# Altium schematic sheet Sheet1.SchDoc
size A
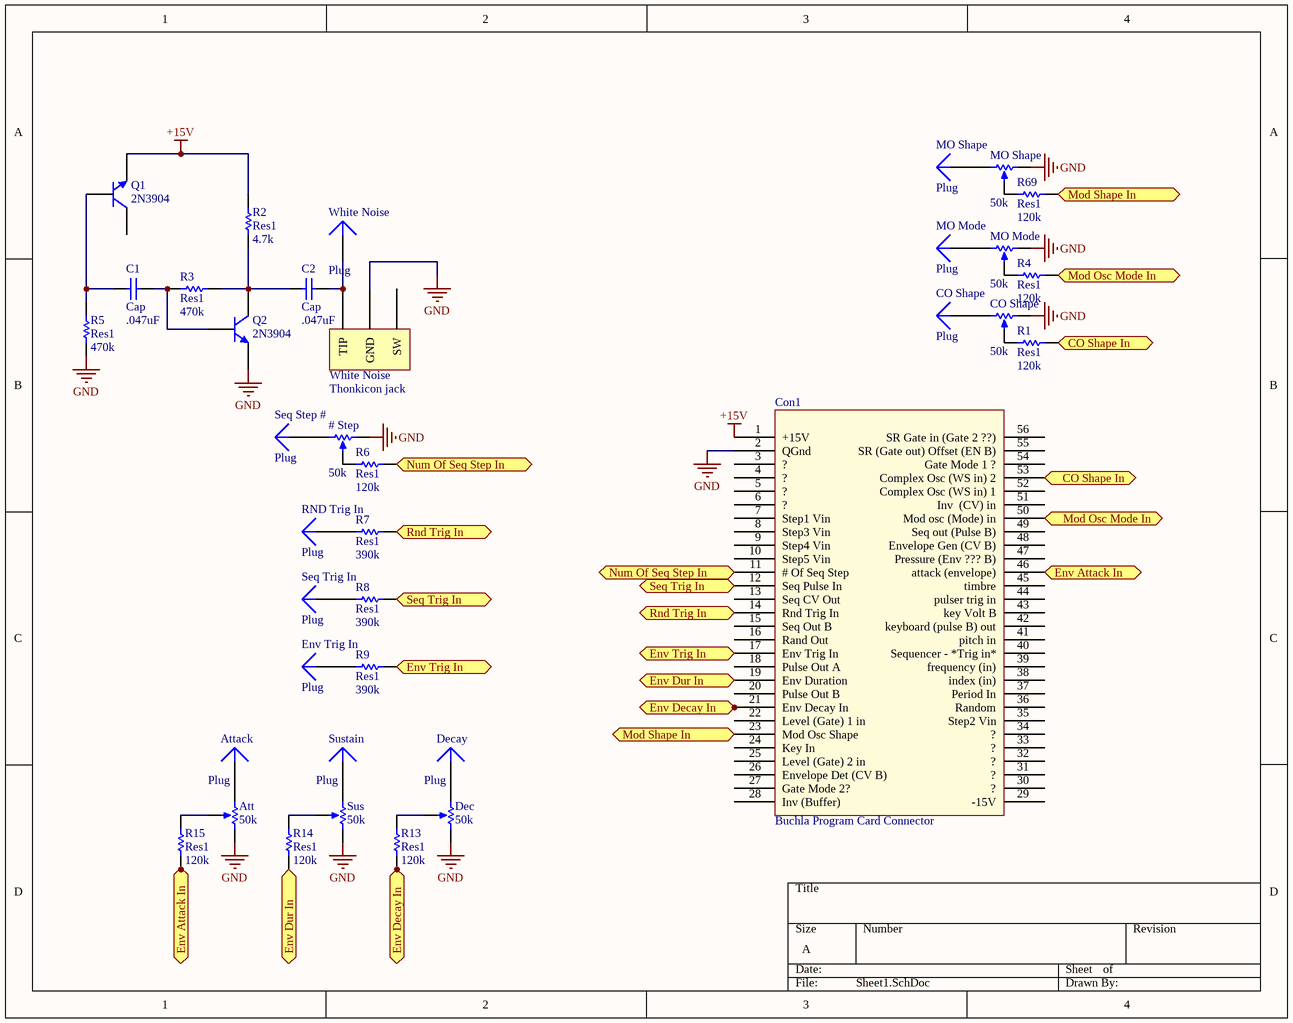
[diagram p0: Sheet1.SchDoc]

## Parts
(Parts that share a designator on the sheet are numbered #1, #2 ... from top to bottom, then left to right.)
#_Step  50k  [SonGueiPot]
Att  50k  [SonGueiPot]
Attack  Plug  [PIN1]
C1  Cap  value .047uF  [RAD-0.3]
C2  Cap  value .047uF  [RAD-0.3]
CO_Shape#1  Plug  [PIN1]
CO_Shape#2  50k  [SonGueiPot]
Con1  Buchla Program Card Connector  [PCBComponent_1]
Dec  50k  [SonGueiPot]
Decay  Plug  [PIN1]
Env_Trig_In  Plug  [PIN1]
MO_Mode#1  Plug  [PIN1]
MO_Mode#2  50k  [SonGueiPot]
MO_Shape#1  Plug  [PIN1]
MO_Shape#2  50k  [SonGueiPot]
Q1  2N3904  [TO-92A]
Q2  2N3904  [TO-92A]
R1  Res1  value 120k  [AXIAL-0.3]
R2  Res1  value 4.7k  [AXIAL-0.3]
R3  Res1  value 470k  [AXIAL-0.3]
R4  Res1  value 120k  [AXIAL-0.3]
R5  Res1  value 470k  [AXIAL-0.3]
R6  Res1  value 120k  [AXIAL-0.3]
R7  Res1  value 390k  [AXIAL-0.3]
R8  Res1  value 390k  [AXIAL-0.3]
R9  Res1  value 390k  [AXIAL-0.3]
R13  Res1  value 120k  [AXIAL-0.3]
R14  Res1  value 120k  [AXIAL-0.3]
R15  Res1  value 120k  [AXIAL-0.3]
R69  Res1  value 120k  [AXIAL-0.3]
RND_Trig_In  Plug  [PIN1]
Seq_Step_#  Plug  [PIN1]
Seq_Trig_In  Plug  [PIN1]
Sus  50k  [SonGueiPot]
Sustain  Plug  [PIN1]
White_Noise#1  Plug  [PIN1]
White_Noise#2  Thonkicon jack  [Thonkiconn Pot PJ301M]

## Ports
CO Shape In, Env Attack In, Env Decay In, Env Dur In, Env Trig In, Mod Osc Mode In, Mod Shape In, Num Of Seq Step In, Rnd Trig In, Seq Trig In

## Nets
+15V: Con1.1(+15V) Q1.1(E) R2.1
GND: #_Step.1(CCW) Att.1(CCW) CO_Shape#2.1(CCW) Con1.2(QGnd) Dec.1(CCW) MO_Mode#2.1(CCW) MO_Shape#2.1(CCW) Q2.1(E) R5.1 Sus.1(CCW) White_Noise#2.1(GND)
CO Shape In: Con1.53(Complex_Osc_(WS_in)_2) R1.2 ; port CO Shape In
Env Attack In: Con1.46(attack_(envelope)) ; port Env Attack In
Env Decay In: Con1.21(Env_Decay_In) R13.1 ; port Env Decay In
Env Dur In: Con1.19(Env_Duration) R14.1 ; port Env Dur In
Env Trig In: Con1.17(Env_Trig_In) R9.2 ; port Env Trig In
Mod Osc Mode In: Con1.50(Mod_osc_(Mode)_in) R4.2 ; port Mod Osc Mode In
Mod Shape In: Con1.23(Mod_Osc_Shape) R69.2 ; port Mod Shape In
Num Of Seq Step In: Con1.11(#_Of_Seq_Step) R6.2 ; port Num Of Seq Step In
Rnd Trig In: Con1.14(Rnd_Trig_In) R7.2 ; port Rnd Trig In
Seq Trig In: Con1.12(Seq_Pulse_In) R8.2 ; port Seq Trig In
Net#_Step_2: #_Step.2(WIPER) R6.1
Net#_Step_3: #_Step.3(CW) Seq_Step_#.1
NetAtt_2: Att.2(WIPER) R15.2
NetAtt_3: Att.3(CW) Attack.1
NetC1_1: C1.1 Q1.2(B) R5.2
NetC1_2: C1.2 Q2.2(B) R3.2
NetC2_1: C2.1 Q2.3(C) R2.2 R3.1
NetC2_2: C2.2 White_Noise#1.1 White_Noise#2.3(TIP)
NetCO_Shape#1_1: CO_Shape#1.1 CO_Shape#2.3(CW)
NetCO_Shape#2_2: CO_Shape#2.2(WIPER) R1.1
NetDec_2: Dec.2(WIPER) R13.2
NetDec_3: Dec.3(CW) Decay.1
NetEnv_Trig_In_1: Env_Trig_In.1 R9.1
NetMO_Mode#1_1: MO_Mode#1.1 MO_Mode#2.3(CW)
NetMO_Mode#2_2: MO_Mode#2.2(WIPER) R4.1
NetMO_Shape#1_1: MO_Shape#1.1 MO_Shape#2.3(CW)
NetMO_Shape#2_2: MO_Shape#2.2(WIPER) R69.1
NetR7_1: R7.1 RND_Trig_In.1
NetR8_1: R8.1 Seq_Trig_In.1
NetR14_2: R14.2 Sus.2(WIPER)
NetSus_3: Sus.3(CW) Sustain.1

Not connected (* = marked no-connect by the designer): Con1 3(?) 4(?) 5(?) 6(?) 7(Step1_Vin) 8(Step3_Vin) 9(Step4_Vin) 10(Step5_Vin) 13(Seq_CV_Out) 15(Seq_Out_B) 16(Rand_Out) 18(Pulse_Out_A) 20(Pulse_Out_B) 22(Level_(Gate)_1_in) 24(Key_In) 25(Level_(Gate)_2_in) 26(Envelope_Det_(CV_B)) 27(Gate_Mode_2?) 28(Inv_(Buffer)) 29(-15V) 30(?) 31(?) 32(?) 33(?) 34(?) 35(Step2_Vin) 36(Random) 37(Period_In) 38(index_(in)) 39(frequency_(in)) 40(Sequencer_-_*Trig_in*) 41(pitch_in) 42(keyboard_(pulse_B)_out) 43(key_Volt_B) 44(pulser_trig_in) 45(timbre) 47(Pressure_(Env_???_B)) 48(Envelope_Gen_(CV_B)) 49(Seq_out_(Pulse_B)) 51(Inv__(CV)_in) 52(Complex_Osc_(WS_in)_1) 54(Gate_Mode_1_?) 55(SR_(Gate_out)_Offset_(EN_B)) 56(SR_Gate_in_(Gate_2_??)); Q1 3(C); R15 1; White_Noise#2 2(SW)

## Library data of the parts
#_Step Att CO_Shape#2 Dec MO_Mode#2 MO_Shape#2 Sus = CMP-0972-00009-1: Trimming Potentiometer, 5K Ohm +/- 10%, -55 to 125 degC, 3-Pin 19.05 x 4.83 x 6.6 mm THD, Transparent Housing, RoHS; Manufacturer: Bourns; PartNumber: 3006P-7-502ZLF; Resistance (kOhm): 5; Resistance Tolerance: +/- 10%; Rotational Life: 200 Cycles; Number of Turns: 15; PackageDescription: 3-Pin THD, Body 19.05 x 4.83 mm, Height 6.6 mm; ComponentLink3Description: Package Specification; ComponentLink1URL: http://www.bourns.com/; PackageReference: 3006P-3; RoHS: TRUE; PackageVersion: Apr-14; Mounting Technology: Through Hole; ComponentLink3URL: http://www.bourns.com/data/global/pdfs/3006.pdf; ComponentLink1Description: Manufacturer URL; Temperature Range: -55 to 125 degC; DatasheetVersion: Apr-14; ComponentLink2Description: Datasheet; ComponentLink2URL: http://www.bourns.com/data/global/pdfs/3006.pdf
C1 C2 = Cap: Capacitor; Published: 8-Jun-2000; LatestRevisionDate: 17-Jul-2002; LatestRevisionNote: Re-released for DXP Platform.; PackageReference: RAD-0.3; Publisher: Altium Limited; PackageDescription: Radial Cap, Thru-Hole; 2 Leads; 0.3 in Pin Spacing
Con1 = 208ProgramCard
Q1 Q2 = 2N3904: NPN General Purpose Amplifier; Published: 8-Jun-2000; LatestRevisionDate: 15-Jan-2003; LatestRevisionNote: PCB Footprint 'BCY-W3/D4.7' replaced; DatasheetVersion: 1997; PackageVersion: Sep-1998; PackageReference: TO-92A; Publisher: Altium Limited; PackageDescription: TO, Flat Index; 3 In-Line, Axial Leads; Body Dia. 4.5mm; Leads 0.51 x 0.48 mm (max); ComponentLink1Description: Manufacturer Link; ComponentLink1URL: http://www.fairchildsemi.com/; ComponentLink2Description: Datasheet; ComponentLink2URL: http://www.fairchildsemi.com/ds/2N%2F2N3904.pdf
R1-R9 R13-R15 R69 = Res1: Resistor; Published: 8-Jun-2000; LatestRevisionDate: 17-Jul-2002; LatestRevisionNote: Re-released for DXP Platform.; PackageReference: AXIAL-0.3; Publisher: Altium Limited; PackageDescription: Axial Device, Thru-Hole; 2 Leads; 0.3 in Pin Spacing
Attack CO_Shape#1 Decay Env_Trig_In MO_Mode#1 MO_Shape#1 RND_Trig_In Seq_Step_# Seq_Trig_In Sustain White_Noise#1 = Plug: LatestRevisionDate: 17-Jul-2002; LatestRevisionNote: Re-released for DXP Platform.; Publisher: Altium Limited